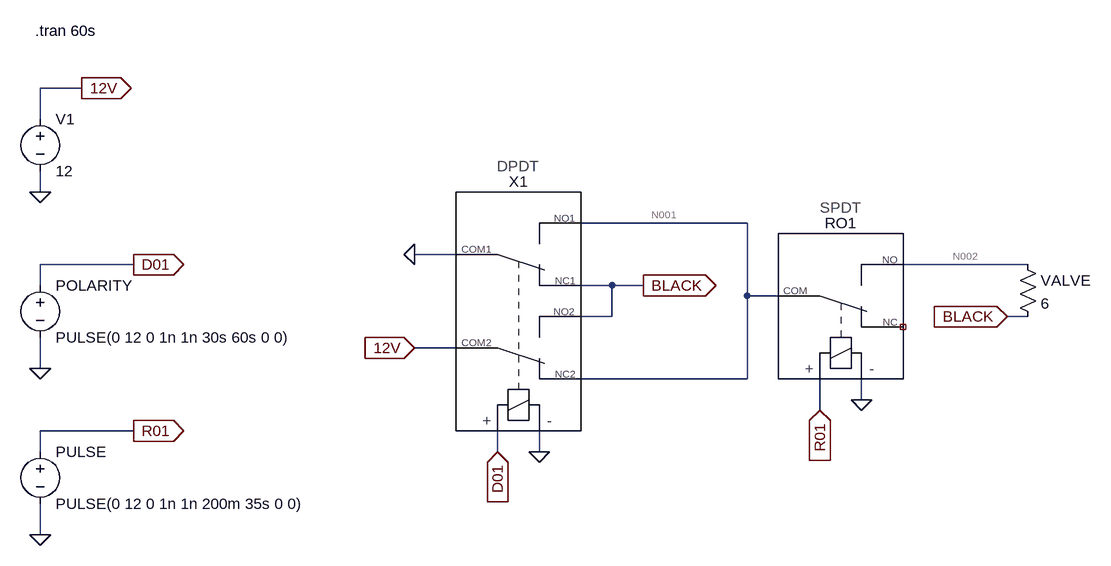
[diagram p0: schematic relay_test_dpdt.asc]
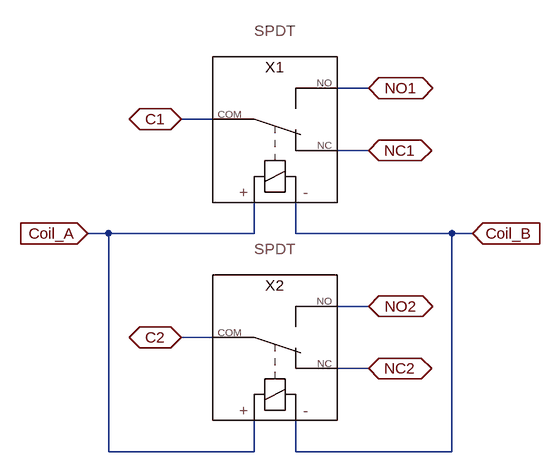
[diagram p1: sub-circuit relay_dpdt.asc]
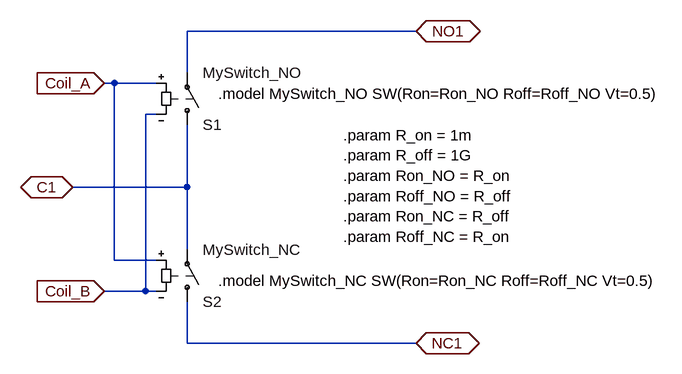
[diagram p2: sub-circuit relay_spdt.asc]
relay_test_dpdt.asc, the LTspice schematic file:
Version 4
SHEET 1 1296 896
WIRE -368 -240 -432 -240
WIRE -432 -192 -432 -240
WIRE -432 -80 -432 -112
WIRE 656 -32 400 -32
WIRE 208 16 144 16
WIRE -288 32 -432 32
WIRE 1088 32 896 32
WIRE -432 64 -432 32
WIRE 448 64 400 64
WIRE 496 64 448 64
WIRE 656 80 656 -32
WIRE 704 80 656 80
WIRE 448 112 448 64
WIRE 448 112 400 112
WIRE 1088 112 1056 112
WIRE 208 160 144 160
WIRE -432 192 -432 144
WIRE 656 208 656 80
WIRE 656 208 400 208
WIRE 832 240 832 208
WIRE 768 256 768 208
WIRE -288 288 -432 288
WIRE -432 320 -432 288
WIRE 272 320 272 288
WIRE 336 320 336 288
WIRE -432 448 -432 400
FLAG -432 -80 0
FLAG -288 32 D01
IOPIN -288 32 Out
FLAG -432 192 0
FLAG -368 -240 12V
IOPIN -368 -240 Out
FLAG 144 160 12V
IOPIN 144 160 In
FLAG 144 16 0
IOPIN 144 16 In
FLAG 1056 112 BLACK
IOPIN 1056 112 In
FLAG 496 64 BLACK
IOPIN 496 64 Out
FLAG 336 320 0
FLAG 832 240 0
FLAG -432 448 0
FLAG -288 288 R01
IOPIN -288 288 Out
FLAG 768 256 R01
IOPIN 768 256 In
FLAG 272 320 D01
IOPIN 272 320 In
SYMBOL voltage -432 -208 R0
WINDOW 123 0 0 Left 0
WINDOW 39 0 0 Left 0
SYMATTR InstName V1
SYMATTR Value 12
SYMBOL voltage -432 48 R0
WINDOW 123 0 0 Left 0
WINDOW 39 0 0 Left 0
SYMATTR InstName POLARITY
SYMATTR Value PULSE(0 12 0 1n 1n 30s 60s 0 0)
SYMBOL Relay_DPDT 304 176 R0
SYMATTR InstName X1
SYMBOL Res 1072 16 R0
SYMATTR InstName VALVE
SYMATTR Value 6
SYMBOL relay_spdt 800 96 R0
SYMATTR InstName RO1
SYMBOL voltage -432 304 R0
WINDOW 123 0 0 Left 0
WINDOW 39 0 0 Left 0
SYMATTR InstName PULSE
SYMATTR Value PULSE(0 12 0 1n 1n 200m 35s 0 0)
TEXT -440 -328 Left 2 !.tran 60s

relay_dpdt.asc, the sub-circuit schematic file:
Version 4
SHEET 1 880 680
WIRE 384 -16 336 -16
WIRE 144 32 96 32
WIRE 384 80 336 80
WIRE -16 208 -48 208
WIRE 208 208 208 160
WIRE 208 208 -16 208
WIRE 272 208 272 160
WIRE 512 208 272 208
WIRE 544 208 512 208
WIRE 384 320 336 320
WIRE 144 368 96 368
WIRE 384 416 336 416
WIRE -16 544 -16 208
WIRE 208 544 208 496
WIRE 208 544 -16 544
WIRE 272 544 272 496
WIRE 512 544 512 208
WIRE 512 544 272 544
FLAG 96 32 C1
IOPIN 96 32 BiDir
FLAG 96 368 C2
IOPIN 96 368 BiDir
FLAG 384 -16 NO1
IOPIN 384 -16 BiDir
FLAG 384 80 NC1
IOPIN 384 80 BiDir
FLAG 384 320 NO2
IOPIN 384 320 BiDir
FLAG 384 416 NC2
IOPIN 384 416 BiDir
FLAG -48 208 Coil_A
IOPIN -48 208 In
FLAG 544 208 Coil_B
IOPIN 544 208 In
SYMBOL Relay_SPDT 240 48 R0
WINDOW 0 0 -96 Center 2
SYMATTR InstName X1
SYMBOL Relay_SPDT 240 384 R0
WINDOW 0 0 -96 Center 2
SYMATTR InstName X2

relay_spdt.asc, the sub-circuit schematic file:
Version 4
SHEET 1 988 680
WIRE 592 -64 240 -64
WIRE 240 0 240 -64
WIRE 128 16 112 16
WIRE 192 16 128 16
WIRE 192 64 176 64
WIRE 240 176 240 80
WIRE 240 176 64 176
WIRE 240 272 240 176
WIRE 128 288 128 16
WIRE 192 288 128 288
WIRE 176 336 176 64
WIRE 176 336 112 336
WIRE 192 336 176 336
WIRE 240 416 240 352
WIRE 592 416 240 416
FLAG 592 -64 NO1
IOPIN 592 -64 BiDir
FLAG 592 416 NC1
IOPIN 592 416 BiDir
FLAG 64 176 C1
IOPIN 64 176 BiDir
FLAG 112 16 Coil_A
IOPIN 112 16 In
FLAG 112 336 Coil_B
IOPIN 112 336 In
SYMBOL sw 240 96 M180
SYMATTR InstName S1
SYMATTR Value MySwitch_NO
SYMBOL sw 240 368 M180
SYMATTR InstName S2
SYMATTR Value MySwitch_NC
TEXT 288 32 Left 2 !.model MySwitch_NO SW(Ron=Ron_NO Roff=Roff_NO Vt=0.5)
TEXT 288 320 Left 2 !.model MySwitch_NC SW(Ron=Ron_NC Roff=Roff_NC Vt=0.5)
TEXT 480 96 Left 2 !.param R_on = 1m\n.param R_off = 1G\n.param Ron_NO = R_on\n.param Roff_NO = R_off\n.param Ron_NC = R_off\n.param Roff_NC = R_on

The netlist it stands for:
* relay_test_dpdt.asc
V1 12V 0 12
V§POLARITY D01 0 PULSE(0 12 0 1n 1n 30s 60s 0 0)
XX1 D01 0 0 N001 BLACK 12V BLACK N001 relay_dpdt
R§VALVE N002 BLACK 6
XRO1 R01 0 N001 N002 NC_01 relay_spdt
V§PULSE R01 0 PULSE(0 12 0 1n 1n 200m 35s 0 0)

* block symbol definitions
.subckt relay_dpdt Coil_A Coil_B C1 NO1 NC1 C2 NO2 NC2
XX1 Coil_A Coil_B C1 NO1 NC1 relay_spdt
XX2 Coil_A Coil_B C2 NO2 NC2 relay_spdt
.ends relay_dpdt

.subckt relay_spdt Coil_A Coil_B C1 NO1 NC1
S1 C1 NO1 Coil_A Coil_B MySwitch_NO
S2 NC1 C1 Coil_A Coil_B MySwitch_NC
.model MySwitch_NO SW(Ron=Ron_NO Roff=Roff_NO Vt=0.5)
.model MySwitch_NC SW(Ron=Ron_NC Roff=Roff_NC Vt=0.5)
.param R_on = 1m
.param R_off = 1G
.param Ron_NO = R_on
.param Roff_NO = R_off
.param Ron_NC = R_off
.param Roff_NC = R_on
.ends relay_spdt

.tran 60s
.backanno
.end

* Results of the author's LTspice run, read from the files saved beside the schematic
* Operating Point, zero values left out:
*   V(12v) = 12 V
*   V(n001) = 12 V
*   V(n002) = 72.1 nV
*   I(Valve) = 12.01 nA
*   I(V1) = -36.04 nA
*   Ix(x1:C1) = -36.04 nA
*   Ix(x1:NO1) = 12.01 nA
*   Ix(x1:NC1) = 24.02 nA
*   Ix(x1:C2) = 36.04 nA
*   Ix(x1:NO2) = -12.01 nA
*   Ix(x1:NC2) = -24.03 nA
*   Ix(ro1:C1) = 12.01 nA
*   Ix(ro1:NO1) = -12.01 nA
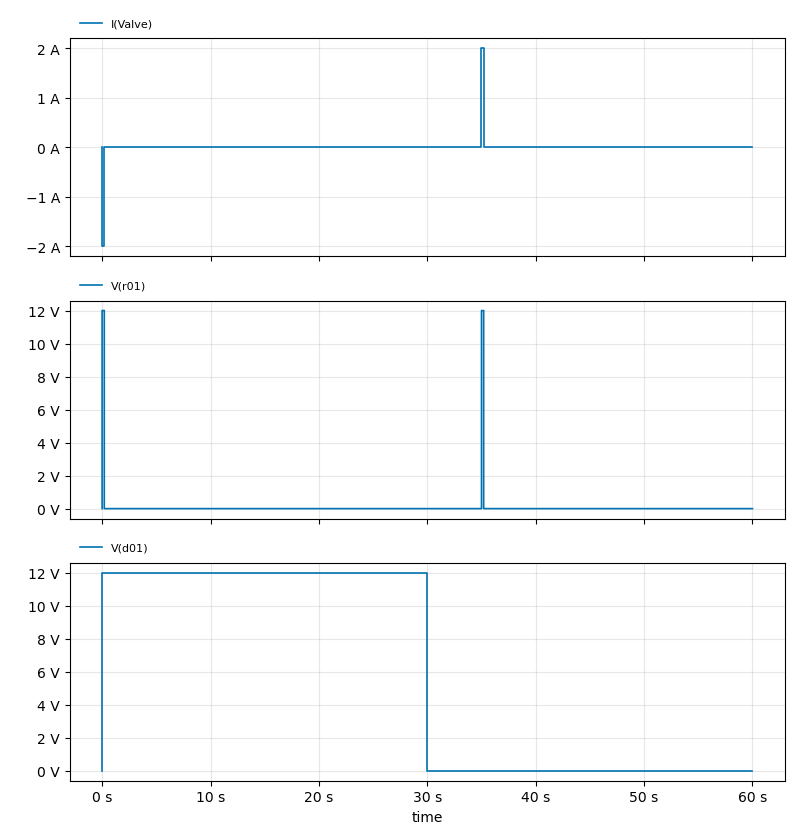
[diagram p3: Transient Analysis of relay_test_dpdt.asc, plotted from the saved traces]
* Transient Analysis, 1 run:
*   I(Valve): min -1.999 A, max 1.999 A, average 0 A, rms 163.2 mA, last 0 A
*   V(r01): min 0 V, max 12 V, average 80 mV, rms 979.8 mV, last 0 V
*   V(d01): min 0 V, max 12 V, average 6 V, rms 8.485 V, last 0 V